# Altium schematic sheet EDU_High-Speed-Design_Power_3V3_1V375.SchDoc: 3V3 1V375
size 431 x 279 mm; Date: not used; ApprovedBy: not used; CheckedBy: not used; Author: not used; DrawnBy: not used; Organization: not used; Address4: not used; SheetNumber: 5; SheetTotal: 26; Time: not used; ImagePath: not used; Application_BuildNumber: not used
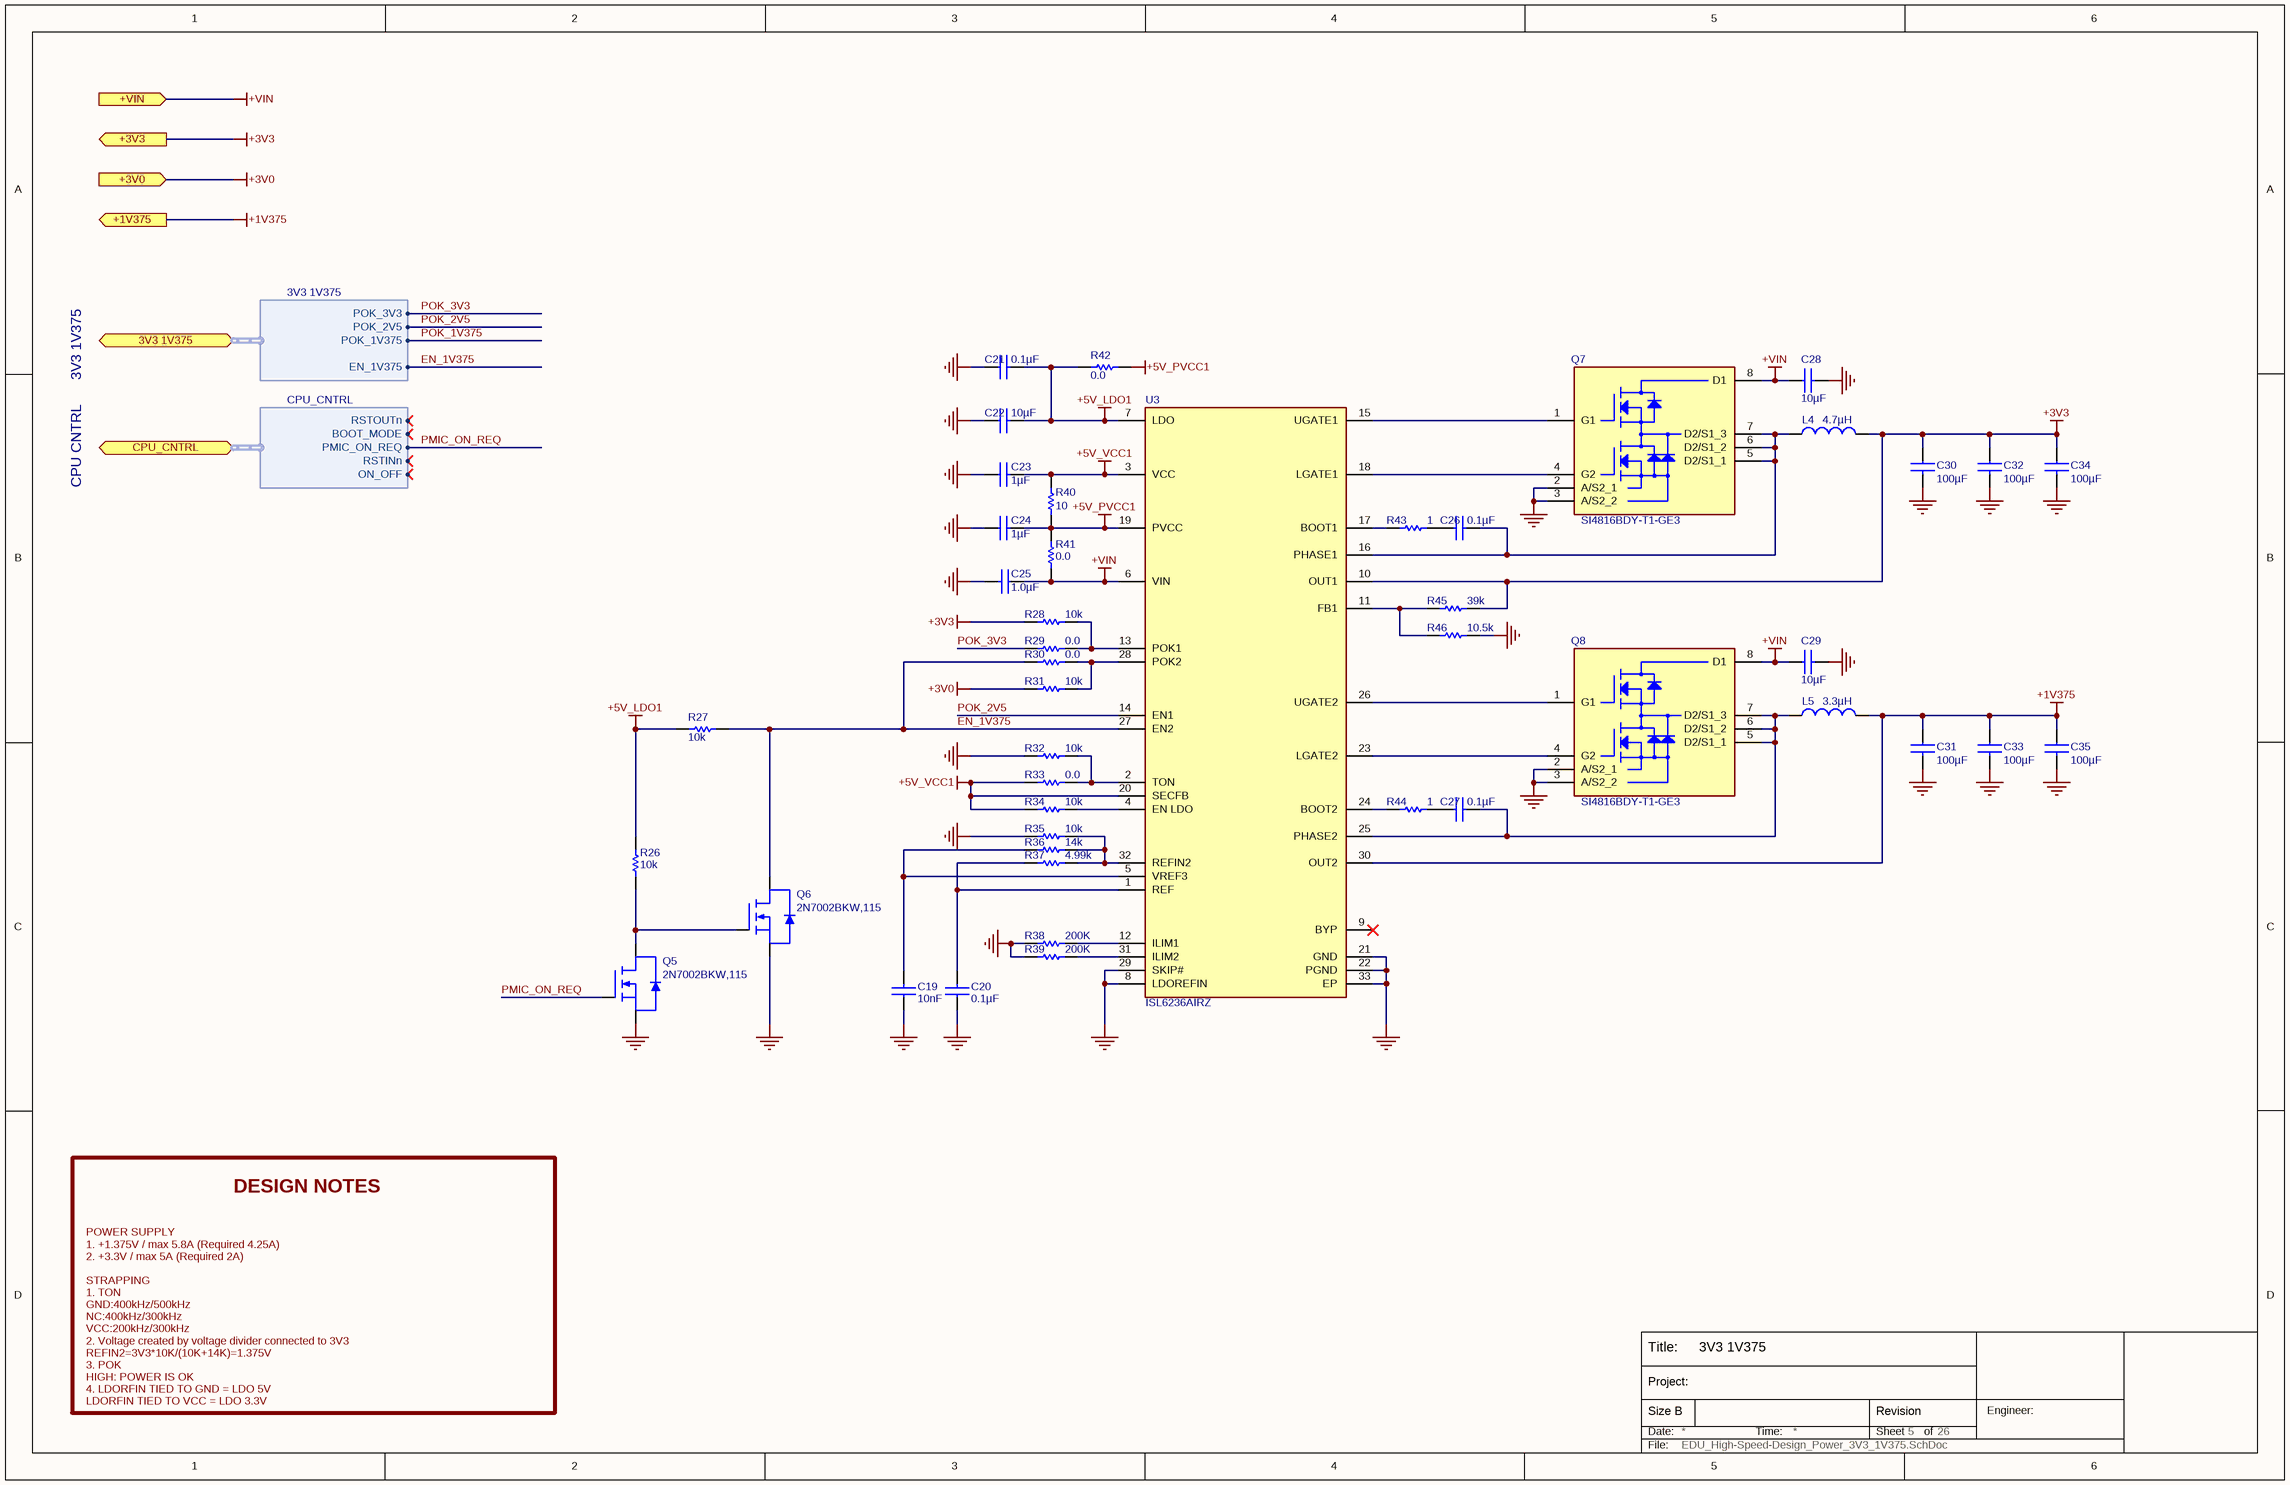
[diagram p0: EDU_High-Speed-Design_Power_3V3_1V375.SchDoc]

## Parts
C19  10nF  [C0402]
C20  0.1µF  [C0402]
C21  0.1µF  [C0402]
C22  10µF  [C0603]
C23  1µF  [C0402]
C24  1µF  [C0402]
C25  1.0µF  [C0805]
C26  0.1µF  [C0402]
C27  0.1µF  [C0402]
C28  10µF  [C1206]
C29  10µF  [C1206]
C30  100µF  [C1206]
C31  100µF  [C1206]
C32  100µF  [C1206]
C33  100µF  [C1206]
C34  100µF  [C1206]
C35  100µF  [C1206]
L4  4.7µH  [IHLP2525]
L5  3.3µH  [IHLP2525]
Q5  2N7002BKW,115  [SOT-23-3]
Q6  2N7002BKW,115  [SOT-23-3]
Q7  SI4816BDY-T1-GE3  [SO8]
Q8  SI4816BDY-T1-GE3  [SO8]
R26  10k  [R0402]
R27  10k  [R0402]
R28  10k  [R0402]
R29  0.0  [R0402]
R30  0.0  [R0402]
R31  10k  [R0402]
R32  10k  [R0402]
R33  0.0  [R0402]
R34  10k  [R0402]
R35  10k  [R0402]
R36  14k  [R0402]
R37  4.99k  [R0402]
R38  200K  [R0402]
R39  200K  [R0402]
R40  10  [R0402]
R41  0.0  [R0402]
R42  0.0  [R0402]
R43  1  [R0402]
R44  1  [R0402]
R45  39k  [R0402]
R46  10.5k  [R0402]
U3  ISL6236AIRZ  [ISL6236AIRZ]

## Ports
3V3 1V375 (bidir, harness 3V3 1V375), +1V375 (out), +3V0 (in), +3V3 (out), +VIN (in), CPU_CNTRL (bidir, harness CPU_CNTRL)

## Harnesses
3V3 1V375: POK_3V3, POK_1V375, POK_2V5, EN_1V375
CPU_CNTRL: RSTOUTn, PMIC_ON_REQ, ON_OFF, BOOT_MODE, RSTINn

## Nets
+1V375: C31.1 C33.1 C35.1 L5.2 U3.30(OUT2) ; port +1V375
+3V0: R31.2 ; port +3V0
+3V3: C30.1 C32.1 C34.1 L4.2 R28.2 R45.1 U3.10(OUT1) ; port +3V3
+5V_LDO1: C21.2 C22.2 R26.2 R27.2 R42.1 U3.7(LDO)
+5V_PVCC1: C24.2 R40.2 R41.1 R42.2 U3.19(PVCC)
+5V_VCC1: C23.2 R33.2 R34.2 R40.1 U3.3(VCC) U3.20(SECFB)
+VIN: C25.1 C28.1 C29.1 Q7.8(D1) Q8.8(D1) R41.2 U3.6(VIN) ; port +VIN
GND: C19.1 C20.1 C21.1 C22.1 C23.1 C24.1 C25.2 C28.2 C29.2 C30.2 C31.2 C32.2 C33.2 C34.2 C35.2 Q5.2(S) Q6.2(S) Q7.2(A/S2_1) Q7.3(A/S2_2) Q8.2(A/S2_1) Q8.3(A/S2_2) R32.2 R35.2 R38.2 R39.2 R46.1 U3.8(LDOREFIN) U3.21(GND) U3.22(PGND) U3.29(SKIP#) U3.33(EP)
EN_1V375: Q6.3(D) R27.1 R30.2 U3.27(EN2) ; port 3V3 1V375.EN_1V375
PMIC_ON_REQ: Q5.1(G) ; port CPU_CNTRL.PMIC_ON_REQ
POK_1V375: port 3V3 1V375.POK_1V375
POK_2V5: U3.14(EN1) ; port 3V3 1V375.POK_2V5
POK_3V3: R29.2 ; port 3V3 1V375.POK_3V3
NetC19_2: C19.2 R36.2 U3.5(VREF3)
NetC20_2: C20.2 R37.1 U3.1(REF)
NetC26_1: C26.1 R43.1
NetC26_2: C26.2 L4.1 Q7.5(D2/S1_1) Q7.6(D2/S1_2) Q7.7(D2/S1_3) U3.16(PHASE1)
NetC27_1: C27.1 R44.1
NetC27_2: C27.2 L5.1 Q8.5(D2/S1_1) Q8.6(D2/S1_2) Q8.7(D2/S1_3) U3.25(PHASE2)
NetQ5_3: Q5.3(D) Q6.1(G) R26.1
NetQ7_1: Q7.1(G1) U3.15(UGATE1)
NetQ7_4: Q7.4(G2) U3.18(LGATE1)
NetQ8_1: Q8.1(G1) U3.26(UGATE2)
NetQ8_4: Q8.4(G2) U3.23(LGATE2)
NetR28_1: R28.1 R29.1 U3.13(POK1)
NetR30_1: R30.1 R31.1 U3.28(POK2)
NetR32_1: R32.1 R33.1 U3.2(TON)
NetR34_1: R34.1 U3.4(EN_LDO)
NetR35_1: R35.1 R36.1 R37.2 U3.32(REFIN2)
NetR38_1: R38.1 U3.12(ILIM1)
NetR39_1: R39.1 U3.31(ILIM2)
NetR43_2: R43.2 U3.17(BOOT1)
NetR44_2: R44.2 U3.24(BOOT2)
NetR45_2: R45.2 R46.2 U3.11(FB1)

Not connected (* = marked no-connect by the designer): U3 9(BYP)*

## Notes on the sheet
- 3V3 1V375
- CPU CNTRL
- DESIGN NOTES
- POWER SUPPLY
  1. +1.375V / max 5.8A (Required 4.25A)
  2. +3.3V / max 5A (Required 2A)
  STRAPPING
  1. TON
  GND:400kHz/500kHz
  NC:400kHz/300kHz
  VCC:200kHz/300kHz
  2. Voltage created by voltage divider connected to 3V3
  REFIN2=3V3*10K/(10K+14K)=1.375V
  3. POK
  HIGH: POWER IS OK
  4. LDORFIN TIED TO GND = LDO 5V
  LDORFIN TIED TO VCC = LDO 3.3V
- Title:
- Date:
- Size B
- Project:
- Time:
- Sheet
- Revision
- of
- Engineer:
- File:

## Library data of the parts
C19 = C1005X7R1C103K: CAP CER 10000PF 16V X7R 10% 0402; Manufacturer: TDK Corporation; Capacitance: 10nF; Manufacturer Part Number: C1005X7R1C103K; Voltage: 16V; Supplier 1: Digi-Key; Supplier Part Number 1: 445-1262-1-ND; ComponentLink1URL: http://www.tdk.co.jp/tefe02/e412_c.pdf; ComponentLink1Description: http://www.tdk.co.jp/tefe02/e412_c.pdf
C20 C21 C26 C27 = C1005X5R1H104K: CAP CER .10UF 50V X5R 10% 0402; Manufacturer 1: TDK Corporation; Capacitance: 0.1µF; Manufacturer Part Number 1: C1005X5R1H104K; Voltage: 50V; Supplier 1: Digi-Key; Supplier Part Number 1: 445-5942-1-ND; ComponentLink1URL: http://www.tdk.co.jp/tefe02/e412_c.pdf; ComponentLink1Description: http://www.tdk.co.jp/tefe02/e412_c.pdf
C22 = C1608X5R0J106M: CAP CER 10UF 6.3V X5R 20% 0603; Manufacturer 1: TDK Corporation; Capacitance: 10µF; Manufacturer Part Number 1: C1608X5R0J106M; Voltage: 6.3V; Supplier 1: Digi-Key; Supplier Part Number 1: 445-4112-1-ND; ComponentLink1URL: http://www.tdk.com/pdf/general_B11.pdf; ComponentLink1Description: http://www.tdk.com/pdf/general_B11.pdf
C23 C24 = C1005X5R1C105K: CAP CER 1.0UF 16V X5R 0402; Manufacturer 1: TDK Corporation; Capacitance: 1µF; Manufacturer Part Number 1: C1005X5R1C105K; Voltage: 16V; Supplier 1: Digi-Key; Supplier Part Number 1: 445-4978-1-ND; ComponentLink1URL: http://www.tdk.co.jp/tefe02/e412_c.pdf; ComponentLink1Description: http://www.tdk.co.jp/tefe02/e412_c.pdf
C25 = GRM21BR71H105KA12L: CAP CER 1UF 50V X7R 0805; Manufacturer 1: Murata Electronics North America; Capacitance: 1.0µF; Manufacturer Part Number 1: GRM21BR71H105KA12L; Supplier 1: Digi-Key; Supplier Part Number 1: 490-4736-1-ND; ComponentLink1URL: http://search.murata.co.jp/Ceramy/image/img/PDF/ENG/GRM21BR71H105KA12.pdf; ComponentLink1Description: http://search.murata.co.jp/Ceramy/image/img/PDF/ENG/GRM21BR71H105KA12.pdf; Voltage: 50V
C28 C29 = GRM31CR6YA106KA12L: CAP CER 10UF 35V X5R 1206; Manufacturer 1: Murata Electronics North America; Capacitance: 10µF; Manufacturer Part Number 1: GRM31CR6YA106KA12L; Supplier 1: Digi-Key; Supplier Part Number 1: 490-5524-1-ND; ComponentLink1URL: http://www.murata.com/products/catalog/pdf/c02e.pdf; ComponentLink1Description: http://www.murata.com/products/catalog/pdf/c02e.pdf; Voltage: 35V
C30-C35 = C3216X5R1A107M: CAP CER 100UF 10V X5R 20% 1206; Manufacturer 1: TDK Corporation; Capacitance: 100µF; Manufacturer Part Number 1: C3216X5R1A107M; Voltage: 10V; Supplier 1: Digi-Key; Supplier Part Number 1: 445-6007-1-ND; ComponentLink1URL: http://www.tdk.com/pdf/general_B11.pdf; ComponentLink1Description: http://www.tdk.com/pdf/general_B11.pdf
L4 = IHLP2525CZER4R7M01: INDUCTOR POWER 4.7UH 5.5A SMD; Manufacturer 1: Vishay/Dale; Current - Saturation: 10A; Manufacturer Part Number 1: IHLP2525CZER4R7M01; Inductance: 4.7µH; Current: 5.5A; Supplier 1: Digi-Key; Supplier Part Number 1: 541-1010-1-ND; ComponentLink1URL: http://www.vishay.com/doc?34104; ComponentLink1Description: http://www.vishay.com/doc?34104
L5 = IHLP2525CZER3R3M01: INDUCTOR POWER 3.3UH 6A SMD; Manufacturer 1: Vishay Dale; Current - Saturation: 13.5A; Supplier 1: Digi-Key; Supplier Part Number 1: 541-1009-1-ND; Manufacturer Part Number 1: IHLP2525CZER3R3M01; Inductance: 3.3µH; Current: 6A; ComponentLink1URL: http://www.vishay.com/doc?34104; ComponentLink1Description: http://www.vishay.com/doc?34104
Q5 Q6 = 2N7002BKW,115: MOSFET N-CH 60V 310MA SOT323; Manufacturer 1: NXP Semiconductors; Supplier 1: Digi-Key; Supplier Part Number 1: 568-5980-1-ND; Manufacturer Part Number 1: 2N7002BKW,115; ComponentLink1URL: http://www.nxp.com/documents/data_sheet/2N7002BKW.pdf; ComponentLink1Description: http://www.nxp.com/documents/data_sheet/2N7002BKW.pdf
Q7 Q8 = SI4816BDY-T1-GE3: MOSFET DL N-CH 30V 6.8A 8-SOIC; Manufacturer 1: Vishay/Siliconix; Manufacturer Part Number 1: SI4816BDY-T1-GE3; Supplier 1: Digi-Key; Supplier Part Number 1: SI4816BDY-T1-GE3CT-ND; ComponentLink1URL: http://www.vishay.com/docs/73026/si4816bd.pdf; ComponentLink1Description: http://www.vishay.com/docs/73026/si4816bd.pdf
R26-R28 R31 R32 R34 R35 = RC0402FR-0710KL: RES 10.0K OHM 1/16W 1% 0402 SMD; Manufacturer 1: Yageo; Manufacturer Part Number 1: RC0402FR-0710KL; Resistance: 10k; Supplier 1: Digi-Key; Supplier Part Number 1: 311-10.0KLRCT-ND; ComponentLink1URL: http://www.yageo.com/documents/recent/PYu-RC0402_51_RoHS_L_6.pdf; ComponentLink1Description: http://www.yageo.com/documents/recent/PYu-RC0402_51_RoHS_L_6.pdf
R29 R30 R33 R41 R42 = RC0402JR-070RL: RES 0.0 OHM 1/16W 0402 SMD; Manufacturer 1: Yageo; Manufacturer Part Number 1: RC0402JR-070RL; Resistance: 0.0; Supplier 1: Digi-Key; Supplier Part Number 1: 311-0.0JRCT-ND; ComponentLink1URL: http://www.yageo.com/documents/recent/PYu-RC0402_51_RoHS_L_6.pdf; ComponentLink1Description: http://www.yageo.com/documents/recent/PYu-RC0402_51_RoHS_L_6.pdf
R36 = RC0402FR-0714KL: RES 14.0K OHM 1/16W 1% 0402 SMD; Manufacturer 1: Yageo; Supplier 1: Digi-Key; Manufacturer Part Number 1: RC0402FR-0714KL; Resistance: 14k; ComponentLink1URL: http://www.yageo.com/documents/recent/PYu-RC0402_51_RoHS_L_6.pdf; ComponentLink1Description: http://www.yageo.com/documents/recent/PYu-RC0402_51_RoHS_L_6.pdf; Supplier Part Number 1: 311-14.0KLRCT-ND
R37 = RMCF0402FT4K99: RES TF 4.99K OHM 1% 1/16W 0402; Manufacturer 1: Stackpole Electronics Inc; Manufacturer Part Number 1: RMCF0402FT4K99; Resistance: 4.99k; Supplier 1: Digi-Key; Supplier Part Number 1: RMCF0402FT4K99CT-ND; ComponentLink1URL: http://www.seielect.com/Catalog/SEI-RMCF.pdf; ComponentLink1Description: http://www.seielect.com/Catalog/SEI-RMCF.pdf
R38 R39 = RC0402FR-07200KL: RES 200K OHM 1/16W 1% 0402 SMD; Manufacturer 1: Yageo; Manufacturer Part Number 1: RC0402FR-07200KL; Resistance: 200K; Supplier 1: Digi-Key; Supplier Part Number 1: 311-200KLRCT-ND; ComponentLink1URL: http://www.yageo.com/documents/recent/PYu-RC0402_51_RoHS_L_6.pdf; ComponentLink1Description: http://www.yageo.com/documents/recent/PYu-RC0402_51_RoHS_L_6.pdf
R40 = RC0402FR-0710RL: RES 10.0 OHM 1/16W 1% 0402 SMD; Manufacturer 1: Yageo; Manufacturer Part Number 1: RC0402FR-0710RL; Resistance: 10; Supplier 1: Digi-Key; Supplier Part Number 1: 311-10.0LRCT-ND; ComponentLink1URL: http://www.yageo.com/documents/recent/PYu-RC0402_51_RoHS_L_6.pdf; ComponentLink1Description: http://www.yageo.com/documents/recent/PYu-RC0402_51_RoHS_L_6.pdf
R43 R44 = RC0402FR-071RL: RES 1.00 OHM 1/16W 1% 0402 SM; Manufacturer 1: Yageo; Manufacturer Part Number 1: RC0402FR-071RL; Resistance: 1; Supplier 1: Digi-Key; Supplier Part Number 1: 311-1.00LRCT-ND; ComponentLink1URL: http://www.yageo.com/documents/recent/PYu-RC0402_51_RoHS_L_6.pdf; ComponentLink1Description: http://www.yageo.com/documents/recent/PYu-RC0402_51_RoHS_L_6.pdf
R45 = RC0402FR-0739KL: RES 39.0K OHM 1/16W 1% 0402 SMD; Manufacturer 1: Yageo; Manufacturer Part Number 1: RC0402FR-0739KL; Resistance: 39k; Supplier 1: Digi-Key; Supplier Part Number 1: 311-39.0KLRCT-ND; ComponentLink1URL: http://www.yageo.com/documents/recent/PYu-RC0402_51_RoHS_L_6.pdf; ComponentLink1Description: http://www.yageo.com/documents/recent/PYu-RC0402_51_RoHS_L_6.pdf
R46 = CRCW040210K5FKED: RES 10.5K OHM 1/16W 1% 0402 SMD; Manufacturer 1: Vishay/Dale; Manufacturer Part Number 1: CRCW040210K5FKED; Resistance: 10.5k; Supplier 1: Digi-Key; Supplier Part Number 1: 541-10.5KLCT-ND; ComponentLink1URL: http://www.vishay.com/doc?20035; ComponentLink1Description: http://www.vishay.com/doc?20035
U3 = ISL6236AIRZ: IC MAIN PWR CTRLR QUAD 32-QFN; Manufacturer 1: Intersil; Manufacturer Part Number 1: ISL6236AIRZ; Supplier 1: Digi-Key; Supplier Part Number 1: ISL6236AIRZ-ND